# Altium schematic sheet ADG.SchDoc: Attack Decay Generator
size Letter; SheetNumber: 3; SheetTotal: 10
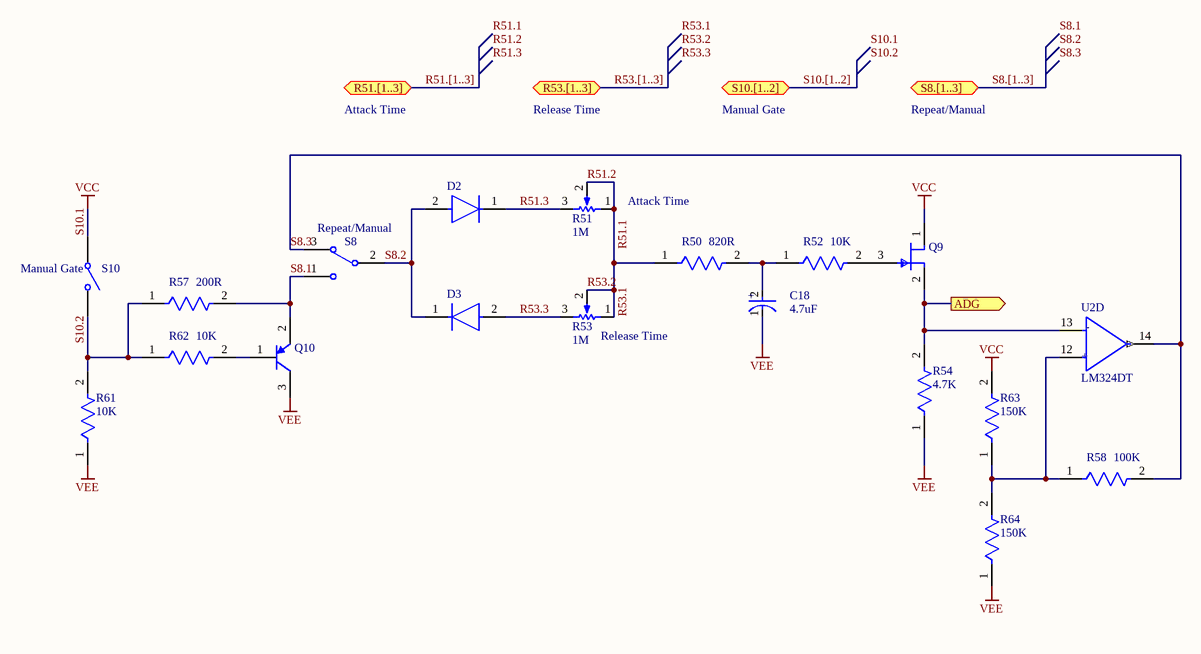
[diagram p0: ADG.SchDoc]

## Parts
C18  Capacitance: 4.7uF  [FP-OS-CON-SMT-A5-MFG]
D2  1N4448WS-7-F  [FP-SOD323-MFG]  (value not drawn)
D3  1N4448WS-7-F  [FP-SOD323-MFG]  (value not drawn)
Q9  MMBFJ113  [FP-318BM-IPC_C]  (value not drawn)
Q10  MMBT3906LT1G  [ONSC-SOT-23-3-318-08_V]  (value not drawn)
R50  Resistance: 820R  [FP-ESR03-IPC_B]  (hidden comment: ESR03EZPJ821)
R51  Attack Time  value 1M  [VR5]  (graphical)
R52  Resistance: 10K  [FP-ESR03-IPC_B]  (hidden comment: ESR03EZPJ103)
R53  Release Time  value 1M  [VR5]  (graphical)
R54  Resistance: 4.7K  [FP-ESR03-IPC_B]  (hidden comment: ESR03EZPJ472)
R57  Resistance: 200R  [FP-ESR03-IPC_B]  (hidden comment: ESR03EZPJ201)
R58  Resistance: 100K  [FP-ESR03-IPC_B]  (hidden comment: ESR03EZPJ104)
R61  Resistance: 10K  [FP-ESR03-IPC_B]  (hidden comment: ESR03EZPJ103)
R62  Resistance: 10K  [FP-ESR03-IPC_B]  (hidden comment: ESR03EZPJ103)
R63  Resistance: 150K  [FP-ESR03-IPC_B]  (hidden comment: ESR03EZPJ154)
R64  Resistance: 150K  [FP-ESR03-IPC_B]  (hidden comment: ESR03EZPJ154)
S8  Repeat/Manual  [HDR1X3]  (graphical)
S10  Manual Gate  [HDR1X2]  (graphical)
U2  LM324DT  [FP-SO-14-MFG]  (part D of 4)

## Ports
ADG (out), R51.[1..3] (bidir), R53.[1..3] (bidir), S8.[1..3] (bidir), S10.[1..2] (bidir)

## Nets
S10.1: Q9.1(D) R63.2 S10.1(COMMON)  [also labelled VCC]
VEE: C18.1(C) Q10.3(C) R54.1 R61.1 R64.1
ADG: Q9.2(S) R54.2 U2.13(Inverting_Input_4) ; port ADG
R51.1: R50.1 R51.1(TOP) R51.2(TAP) R53.1(TOP) R53.2(TAP)  [also labelled R51.2, R53.1, R53.2]
R51.3: D2.1(C) R51.3(BOT)
R53.3: D3.2(A) R53.3(BOT)
S8.1: Q10.2(E) R57.2 S8.1
S8.2: D2.2(A) D3.1(C) S8.2
S8.3: R58.2 S8.3 U2.14(Output_4)
S10.2: R57.1 R61.2 R62.1 S10.2(NO)
NetC18_2: C18.2(A) R50.2 R52.1
NetQ9_3: Q9.3(G) R52.2
NetQ10_1: Q10.1(B) R62.2
NetR58_1: R58.1 R63.1 R64.2 U2.12(Non-Inverting_Input_4)

## Buses and harness runs
bus R51.[1..3] = port R51.[1..3]
bus R53.[1..3] = port R53.[1..3]
bus S8.[1..3] = port S8.[1..3]
bus S10.[1..2] = port S10.[1..2]

## Notes on the sheet
- Attack Time
- Release Time
- Manual Gate
- Repeat/Manual
- Labels drawn without touching a wire or pin: R51.1, R51.2, R51.3, R53.1, R53.2, R53.3, S8.1, S8.2, S8.3, S10.1, S10.2
- (in symbol CMP-05427-000158-1) +
- (in symbol CMP-12131-000005-1, part D) -; +

## Library data of the parts
C18 = CMP-05427-000158-1: Manufacturer: Wurth Electronics; Manufacturer Part Number: 865080640004; Material: Aluminium; Tolerance: 20%; Voltage Rating: 50V; Polarity: Polar; Ripple Current: 55mA; Impedance: 4.5R; Life (Hours): 2000Hour; Supplier 1: RSComponents; Supplier Part Number 1: 8391865; RoHS: Yes; Category: Aluminum Electrolytic Capacitors; Stock 1: 1; Pricing 1: 25=0.18500, 125=0.12700, 250=0.11600, 500=0.10400, 2500=0.09800 (USD); Mount: Surface Mount; Case/Package: Radial; Min Operating Temperature: -55°C; Max Operating Temperature: 105°C; Package Quantity: 1; Packaging: Cut Tape; Ripple Current (AC): 55mA; Voltage Rating (DC): 50V; Diameter: 4mm; Height: 5.5mm; Height - Seated (Max): 0.217inch; REACH SVHC: Unknown; RoHS Compliant: Yes; ComponentLink1URL: https://datasheet.ciiva.com/48693/001280472-da-01-en-wcap-asli-alu-elec-caps-865080640004-48693547.pdf?src-supplier=Conrad; ComponentLink1Description: https://datasheet.ciiva.com/48693/001280472-da-01-en-wcap-asli-alu-elec-caps-865080640004-48693547.pdf?src-supplier=Conrad
D2 D3 = CMP-12791-000011-1: DIODE GEN PURP 75V 250MA SOD323; Manufacturer: Diodes Incorporated; Forward Current: 500mA; Max Junction Temp: +150°C; Max Surge Forward Current: 0.5A; Value: 4pF; Peak Reverse Current: 2.5uA; Standoff Height: 0.05mm; ComponentLink2URL: https://www.diodes.com/assets/Datasheets/ds30096.pdf; ComponentLink2Description: Datasheet; Automotive: No; Temperature Range Low: -65°C; Package: SOD323; Temperature Range High: +150°C; Device Class L3: Rectifier Diodes; Reverse Voltage: 75V; Device Class L2: Diodes; Max Repetitive Reverse Voltage: 75V; Manufacturer Part Number: 1N4448WS-7-F; RoHS: TRUE; Lead Free: Yes; Temperature: -65°C to +150°C; Mouser Description: 1N4448WS Series 4 A 75 V 200 mW Surface Mount Fast Switching Diode - SOD-323; Capacitance: 4pF; Height: 1.2mm; Digikey Description: DIODE GEN PURP 75V 250MA SOD323; Octopart: https://octopart.com/1n4448ws-7-f-diodes+inc.-55389585; Footprint Url: https://www.diodes.com/assets/Package-Files/SOD323.pdf; Device Class L1: Discrete Semiconductors; Category: Diode
Q9 = CMP-07172-000001-1: JFET N-CH 35V 350MW SOT23; Manufacturer: ON Semiconductor; Number Of N Channels: 1; Gate To Source Voltage: -35V; Drain To Source Resistance: 100Ω; Standoff Height: 0mm; Rthja Max: 357°C/W; Max Junction Temp: +150°C; Gate to Source Voltage (Vgs): -25V; Element Configuration: Single; Input Capacitance: 7pF; Drain to Source Voltage (Vdss): 25V; Continuous Drain Current (ID): 5mA; Current Rating: 10mA; Polarity: N-CHANNEL; Device Class L2: Transistors; Number Of Channels: 1; ComponentLink2Description: Datasheet; Device Class L3: JFETs; Device Class L1: Discrete Semiconductors; Lead Free: Yes; Power Dissipation: 350mW; Category: Trans; Mouser Description: JFET N-Channel Switch; ComponentLink2URL: https://www.onsemi.com/pub/Collateral/MMBFJ113-D.PDF; RoHS: TRUE; Footprint Url: https://www.onsemi.com/pub/Collateral/318BM.PDF; Height: 1.2mm; Package: 318BM; Temperature Range High: +150°C; Manufacturer Part Number: MMBFJ113; Temperature: -55°C to +150°C; Digikey Description: JFET N-CH 35V 350MW SOT23; Temperature Range Low: -55°C; Octopart: https://octopart.com/mmbfj113-on+semiconductor-84330253; Automotive: No; Ipc Land Pattern Name: SOT95P240X120-3; Supplier 1: Digi-Key; Supplier Part Number 1: MMBF5457CT-ND; Stock 1: 13304; Pricing 1: 1=0.50000, 10=0.39000, 25=0.37280, 100=0.23400, 500=0.21670, 1000=0.14736 (USD); Mount: Surface Mount; Case/Package: SOT-23; Number of Pins: 3; Weight: 0.03g; Contact Plating: Tin,Matte; Min Operating Temperature: -55°C; Max Operating Temperature: 150°C; Packaging: Tape and Reel; Package Quantity: 1; Max Power Dissipation: 350mW; Voltage Rating (DC): 25V; Series: MMBF5457; Length: 2.92mm; Width: 1.3mm; Radiation Hardening: No; RoHS Compliant: Yes; REACH SVHC: No SVHC; ComponentLink1URL: https://datasheet.ciiva.com/25625/0900766b810cdc04-25625787.pdf?src-supplier=RSComponents; ComponentLink1Description: https://datasheet.ciiva.com/25625/0900766b810cdc04-25625787.pdf?src-supplier=RSComponents; ComponentLink3URL: https://datasheet.ciiva.com/8120/mmbf5459-8120391.pdf?src-supplier=Avnet; ComponentLink3Description: https://datasheet.ciiva.com/8120/mmbf5459-8120391.pdf?src-supplier=Avnet; ComponentLink4URL: https://datasheet.ciiva.com/26026/mmbf5459-26026568.pdf?src-supplier=Avnet+Europe; ComponentLink4Description: https://datasheet.ciiva.com/26026/mmbf5459-26026568.pdf?src-supplier=Avnet+Europe; ComponentLink5URL: https://datasheet.ciiva.com/960/mmbf5457-960906.pdf?src-supplier=Digi-Key; ComponentLink5Description: https://datasheet.ciiva.com/960/mmbf5457-960906.pdf?src-supplier=Digi-Key; ComponentLink6URL: https://datasheet.ciiva.com/960/mmbf5457-960907.pdf?src-supplier=Digi-Key; ComponentLink6Description: https://datasheet.ciiva.com/960/mmbf5457-960907.pdf?src-supplier=Digi-Key; ComponentLink7URL: https://datasheet.ciiva.com/46445/46943-46445739.pdf?src-supplier=Element14; ComponentLink7Description: https://datasheet.ciiva.com/46445/46943-46445739.pdf?src-supplier=Element14; ComponentLink8URL: https://datasheet.ciiva.com/960/mmbf5457-960908.pdf?src-supplier=Digi-Key; ComponentLink8Description: https://datasheet.ciiva.com/960/mmbf5457-960908.pdf?src-supplier=Digi-Key; ComponentLink9URL: https://datasheet.ciiva.com/3304/mmbf5459-3304349.pdf?src-supplier=Avnet; ComponentLink9Description: https://datasheet.ciiva.com/3304/mmbf5459-3304349.pdf?src-supplier=Avnet
Q10 = CMP-1048-00670-1: General Purpose Transistor, PNP Silicon, 3-Pin SOT-23, Pb-Free, Tape and Reel; Manufacturer: On Semiconductor; IC Continuous (A): -0.2; fT Min (MHz): 250; PackageDescription: 3-Pin Small Outline Transistor, Body 2.92 x 1.3 mm, Pitch 0.95 mm; PartNumber: MMBT3906LT1G; Packing: Tape and Reel; ComponentLink3Description: Package Specification; Mounting Technology: Surface Mount; ComponentLink3URL: http://www.onsemi.cn/pub_link/Collateral/318-08.PDF; ComponentLink1URL: http://www.onsemi.com/; ComponentLink2URL: http://www.onsemi.cn/pub_link/Collateral/MMBT3906LT1-D.PDF; PackageReference: SOT-23-3-318-08; Polarity: PNP; ComponentLink2Description: Datasheet; PackageVersion: Rev. AP, 11/2009; RoHS: TRUE; DatasheetVersion: Rev. 11; ComponentLink1Description: Manufacturer URL
R50 = CMP-08839-006118-1: 820Ω ±5% 0.25W 0603 Anti-Surge Chip Resistor AEC-Q200; Temperature Coefficient: 200ppm/°C; Max Power Dissipation: 250mW; Length: 0.063inch; Tolerance: 5%; Height: 0.022inch; Case Code (Imperial): 0603; Case/Package: 0603; Features: Automotive AEC-Q200; Resistor Type: Thick Film; Case Code (Metric): 1608; Max Operating Temperature: 155°C; Package Quantity: 5000; Min Operating Temperature: -55°C; Series: ESR; Number of Terminations: 2; Width: 0.031inch; Packaging: Cut Tape; RoHS Compliant: Yes
R51 R53 = RPot: Potentiometer; Sim Note: Enter the Resistance value and the set point into parameter fields.; Set Position: 0.5; Published: 8-Jun-2000; LatestRevisionDate: 17-Jul-2002; LatestRevisionNote: Re-released for DXP Platform.; PackageReference: VR5; Publisher: Altium Limited; PackageDescription: Variable Resistor, Thru-Hole; 3 Leads
R52 R61 R62 = CMP-08839-028975-1: 10kΩ ±5% 0.25W 0603 Anti-Surge Chip Resistor AEC-Q200; Power Rating: 250mW; Temperature Coefficient: 200ppm/°C; Tolerance: 5%; Series: ESR03; Package Quantity: 5000; Length: 0.063inch; Height: 0.022inch; Lead Free: Lead Free; Case/Package: 0603; Case Code (Metric): 1608; Width: 0.031inch; Resistor Type: Thick Film; Max Power Dissipation: 250mW; Packaging: Tape and Reel; Mount: Surface Mount; Number of Terminations: 2; Case Code (Imperial): 0603; Max Operating Temperature: 155°C; Min Operating Temperature: -55°C; RoHS Compliant: Yes
R54 = CMP-08839-007853-1: 4.7kΩ ±5% 0.25W 0603 Anti-Surge Chip Resistor AEC-Q200; Max Power Dissipation: 250mW; Temperature Coefficient: 200ppm/°C; Packaging: Tape and Reel; Series: ESR; Height: 0.022inch; Case Code (Imperial): 0603; Tolerance: 5%; RoHS Compliant: Yes; Case/Package: 0603; Min Operating Temperature: -55°C; Resistor Type: Thick Film; Package Quantity: 5000; Features: Automotive AEC-Q200; Width: 0.031inch; Length: 0.063inch; Max Operating Temperature: 155°C; Number of Terminations: 2
R57 = CMP-08839-005791-1: 200Ω ±5% 0.25W 0603 Anti-Surge Chip Resistor AEC-Q200; Max Power Dissipation: 250mW; Temperature Coefficient: 200ppm/°C; Number of Terminations: 2; Packaging: Tape and Reel; Width: 0.031inch; Features: Automotive AEC-Q200; Max Operating Temperature: 155°C; Case Code (Metric): 1608; Series: ESR; Package Quantity: 5000; Case/Package: 0603; Height: 0.022inch; Tolerance: 5%; Min Operating Temperature: -55°C; Case Code (Imperial): 0603; RoHS Compliant: Yes; Resistor Type: Thick Film; Length: 0.063inch
R58 = CMP-08839-029521-1: 100kΩ ±5% 0.25W 0603 Anti-Surge Chip Resistor AEC-Q200; Power Rating: 200mW; Max Power Dissipation: 250mW; Temperature Coefficient: 200ppm/°C; Length: 0.063inch; Case Code (Imperial): 0603; Case/Package: 0603; Resistor Type: Thick Film; Features: Automotive AEC-Q200; Package Quantity: 1; Width: 0.031inch; Packaging: Cut Tape; Min Operating Temperature: -55°C; Series: ESR; RoHS Compliant: Yes; Size Code: 0603; Tolerance: 5%; Height: 0.022inch; Max Operating Temperature: 155°C; Lead Free: Lead Free; Case Code (Metric): 1608; Number of Terminations: 2
R63 R64 = CMP-08839-028438-1: 150kΩ ±5% 0.25W 0603 Anti-Surge Chip Resistor AEC-Q200; Temperature Coefficient: 200ppm/°C; Max Power Dissipation: 250mW; Case Code (Metric): 1608; Packaging: Cut Tape; Min Operating Temperature: -55°C; Number of Terminations: 2; Package Quantity: 1; Case Code (Imperial): 0603; Series: ESR; Width: 0.031inch; Tolerance: 5%; Length: 0.063inch; Resistor Type: Thick Film; Case/Package: 0603; Max Operating Temperature: 155°C; Height: 0.022inch; RoHS Compliant: Yes; Features: Automotive AEC-Q200
S8 = SW-SPDT: Switch Toggle ON None ON SPDT Round Lever Solder Lug 5A 250VAC 28VDC Panel Mount with Threads; Manufacturer: E-Switch; Manufacturer Part Number: 100SP1T1B1M1QEH; Actuator Material: Brass,Chrome; Actuator Color: Chrome; Voltage Rating (AC): 120V; Voltage Rating (DC): 28V; Max Voltage Rating (AC): 250V; Illumination Type: Illuminated,Non-Illuminated; Switch Function: On-On; Actuator Type: Standard Round; Contact Resistance: 100mR; Electrical Life: 40000Cycles; Actuator Length: 10.41mm; Supplier 1: Newark; Supplier Part Number 1: 15N9971; RoHS: Yes; Category: Toggle Switches; Stock 1: 978; Pricing 1: 1=3.08000, 10=2.76000, 25=2.61000, 50=2.49000, 100=2.37000 (USD); Mount: Panel; Contact Material: Copper Alloy,Silver; Contact Plating: Silver; Housing Material: Stainless Steel; Min Operating Temperature: -30°C; Max Operating Temperature: 85°C; Throw Configuration: SPDT; Current Rating: 5A; Package Quantity: 1; Packaging: Bulk; Max Voltage Rating (DC): 28V; Termination: Solder; Orientation: Straight; Series: 100; REACH SVHC: No SVHC; Lead Free: Lead Free; RoHS Compliant: Yes; ComponentLink1URL: https://datasheet.ciiva.com/2904/st110007c-2904798.pdf?src-supplier=Digi-Key; ComponentLink1Description: https://datasheet.ciiva.com/2904/st110007c-2904798.pdf?src-supplier=Digi-Key; ComponentLink2URL: https://datasheet.ciiva.com/16154/xt0157p-16154561.pdf?src-supplier=Onlinecomponents.com; ComponentLink2Description: https://datasheet.ciiva.com/16154/xt0157p-16154561.pdf?src-supplier=Onlinecomponents.com; ComponentLink3URL: https://datasheet.ciiva.com/16347/100-16347391.pdf?src-supplier=Future+Electronics; ComponentLink3Description: https://datasheet.ciiva.com/16347/100-16347391.pdf?src-supplier=Future+Electronics
S10 = SW-SPST: Pushbutton Switch, SPST-NO, OFF-(ON), Round Red Cap, 3A, 125VAC, Solder, PS1024 Series; Manufacturer: E-Switch; Manufacturer Part Number: PS1024ARED; Mechanical Life: 6000Cycles; Voltage Rating (AC): 125V; Throw Configuration: SPST; Contact Resistance: 50mR; Max Voltage Rating (AC): 250V; Switch Function: Off-Mom; Actuator Type: Round, Button; Life (Hours): 6000Hour; Thread Size: M7; Actuator Length: 8.6mm; Supplier 1: Newark; Supplier Part Number 1: 15N8448; RoHS: Yes; Category: Pushbutton Switches; Stock 1: 744; Pricing 1: 1=1.71000, 10=1.54000, 25=1.45000, 50=1.38000, 100=1.32000, 250=1.26000 (USD); Mount: Bushing,Panel; Actuator Color: Red; Min Operating Temperature: -20°C; Max Operating Temperature: 65°C; Current Rating: 3A; Termination: Solder; Series: PS1024; Packaging: Bulk; Package Quantity: 1; Life (Cycles): 6000Cycles; Electrical Life: 6000Cycles; Orientation: Straight; Diameter: 6.1mm; Lead Free: Lead Free; RoHS Compliant: Yes; ComponentLink1URL: https://datasheet.ciiva.com/2870/ps1024ared-2870125.pdf?src-supplier=Digi-Key; ComponentLink1Description: https://datasheet.ciiva.com/2870/ps1024ared-2870125.pdf?src-supplier=Digi-Key; ComponentLink2URL: https://datasheet.ciiva.com/16293/ps1024ared-16293422.pdf?src-supplier=Future+Electronics; ComponentLink2Description: https://datasheet.ciiva.com/16293/ps1024ared-16293422.pdf?src-supplier=Future+Electronics
U2 = CMP-12131-000005-1: IC OPAMP GP 4 CIRCUIT 14SO; Manufacturer: STMicroelectronics; Voltage Gain: 100dB; Standoff Height: 0.1mm; Bandwidth: 1.3MHz; Max Junction Temp: +150°C; Min Supply Voltage: 3V; Max Dual Supply Voltage: 15V; Min Dual Supply Voltage: 1.5V; Number Of Channels: 4; Nominal Supply Current: 0.7-1.5mA; Output Current Per Channel: 20-50mA; Max Supply Voltage: 30V; Input Offset Voltage: 2mV; Input Bias Current: 0.02uA; Device Class L1: Integrated Circuits (ICs); Device Class L3: Amplifiers - Op Amps; Temperature Range Low: 0°C; Package: SO-14; Temperature Range High: +70°C; Digikey Description: IC OPAMP GP 4 CIRCUIT 14SO; Device Class L2: Linear ICs; Footprint Url: https://www.st.com/content/ccc/resource/technical/document/datasheet/group3/10/8a/e6/12/f8/e8/49/ce/DM00366438/files/DM00366438.pdf/jcr:content/translations/en.DM00366438.pdf; Octopart: https://octopart.com/lm324dt-stmicroelectronics-39579146; ComponentLink2URL: https://www.st.com/content/ccc/resource/technical/document/datasheet/bd/fc/46/43/26/8f/40/7f/CD00001046.pdf/files/CD00001046.pdf/jcr:content/translations/en.CD00001046.pdf; ComponentLink2Description: Datasheet; Lead Free: Yes; Temperature: 0°C to +70°C; RoHS: TRUE; Gain Bandwidth: 1.3MHz; Manufacturer Part Number: LM324DT; Automotive: No; Category: IC; Height: 1.75mm; Mouser Description: LM324 Series 32 V 1.3 MHz Low Power Quad Operational Amplifier - SOIC-14